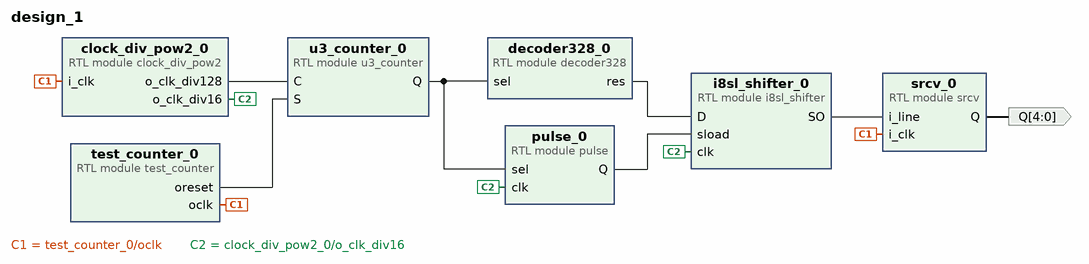
[diagram p0: block diagram of the top level]
# Vivado block design design_1, xa7a100tcsg324-1I, Vivado 2019.2
create_bd_design design_1

create_bd_port -dir O -from 4 -to 0 Q

create_bd_cell -type module -reference clock_div_pow2 clock_div_pow2_0
create_bd_cell -type module -reference decoder328 decoder328_0
create_bd_cell -type module -reference i8sl_shifter i8sl_shifter_0
create_bd_cell -type module -reference pulse pulse_0
create_bd_cell -type module -reference srcv srcv_0
create_bd_cell -type module -reference u3_counter u3_counter_0
create_bd_cell -type module -reference test_counter test_counter_0

# ---- connections ----

connect_bd_net [get_bd_pins test_counter_0/oclk] [get_bd_pins clock_div_pow2_0/i_clk] [get_bd_pins srcv_0/i_clk]
connect_bd_net [get_bd_pins u3_counter_0/Q] [get_bd_pins decoder328_0/sel] [get_bd_pins pulse_0/sel]
connect_bd_net [get_bd_pins decoder328_0/res] [get_bd_pins i8sl_shifter_0/D]
connect_bd_net [get_bd_pins clock_div_pow2_0/o_clk_div16] [get_bd_pins i8sl_shifter_0/clk] [get_bd_pins pulse_0/clk]
connect_bd_net [get_bd_pins i8sl_shifter_0/SO] [get_bd_pins srcv_0/i_line]
connect_bd_net [get_bd_pins pulse_0/Q] [get_bd_pins i8sl_shifter_0/sload]
connect_bd_net [get_bd_pins clock_div_pow2_0/o_clk_div128] [get_bd_pins u3_counter_0/C]
connect_bd_net [get_bd_pins srcv_0/Q] [get_bd_ports Q]
connect_bd_net [get_bd_pins test_counter_0/oreset] [get_bd_pins u3_counter_0/S]

validate_bd_design
save_bd_design
